# Altium schematic sheet Sheet1.SchDoc
size 300 x 200 mm
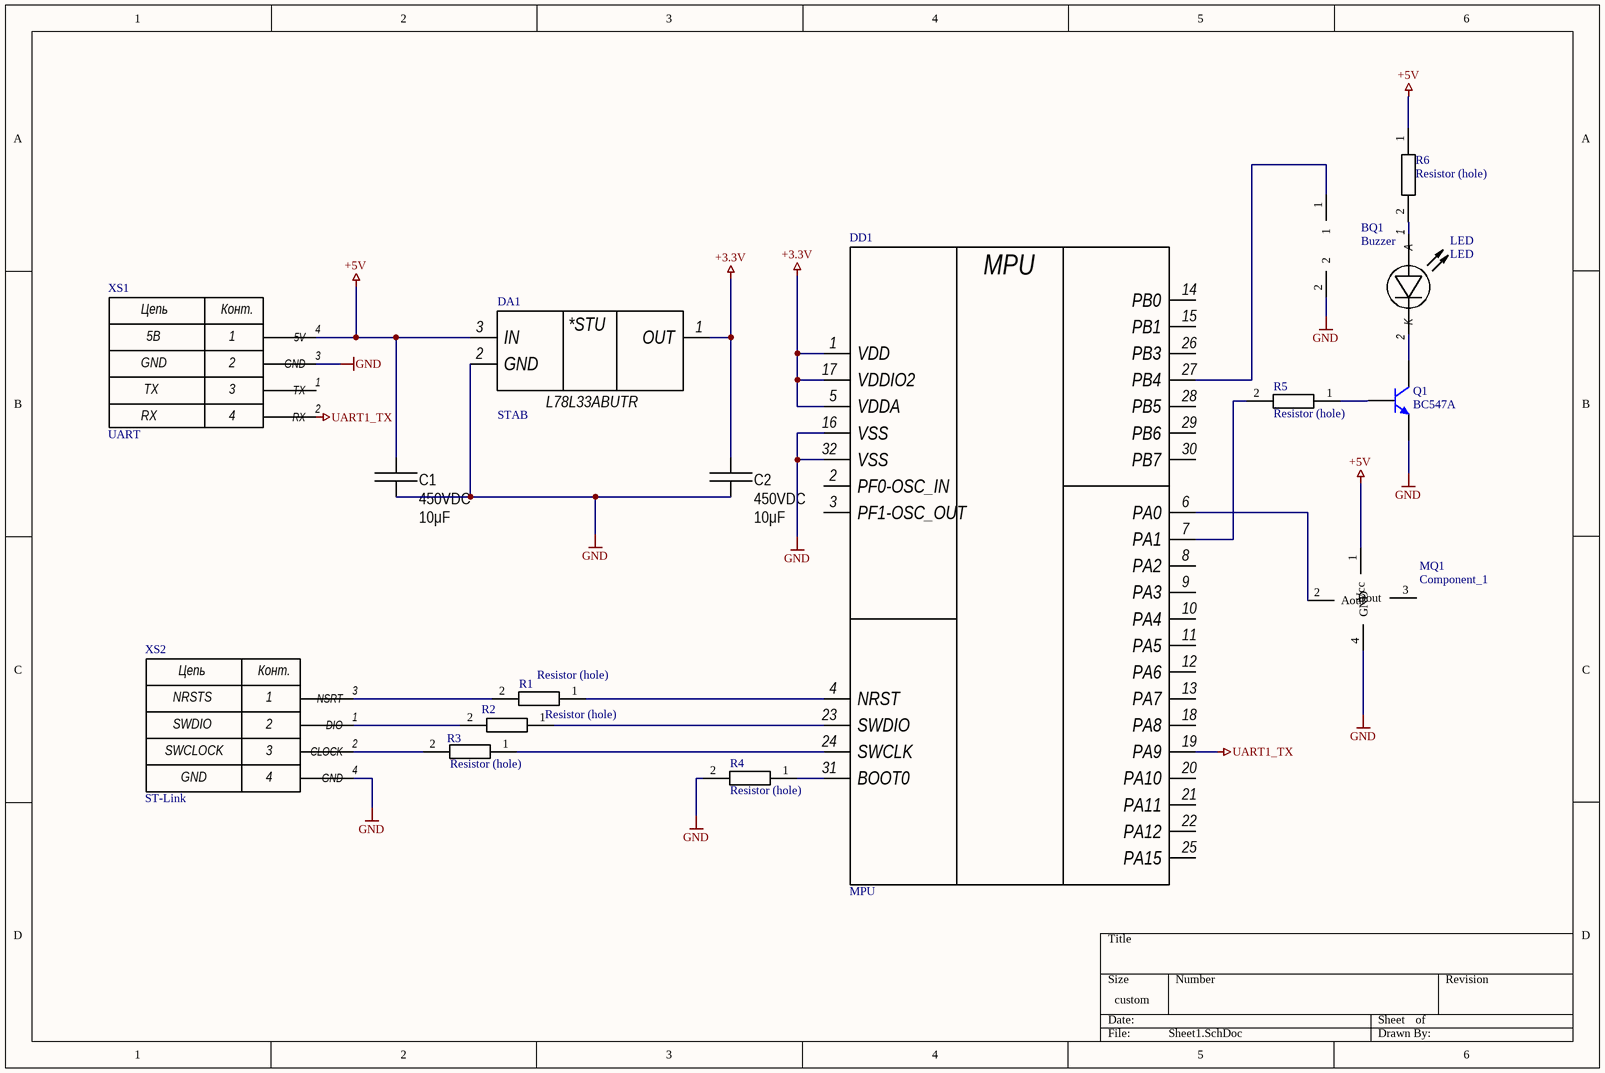
[diagram p0: Sheet1.SchDoc]

## Parts
BQ1  Buzzer  [Buzzer 3V]
C1  value 10μF  Voltage: 450VDC  [CAP: AY2102M29Y5US63L7]
C2  value 10μF  Voltage: 450VDC  [CAP: AY2102M29Y5US63L7]
DA1  STAB  [STAB]
DD1  MPU  [PCBComponent_1]
LED  LED  [LED]
MQ1  Component_1  [Sensor]
Q1  BC547A  [TO-92A]
R1  Resistor (hole)  [Resistor 22]
R2  Resistor (hole)  [Resistor 22]
R3  Resistor (hole)  [Resistor 22]
R4  Resistor (hole)  [Resistor 22]
R5  Resistor (hole)  [Resistor 22]
R6  Resistor (hole)  [Resistor 22]
XS1  UART  [UART]
XS2  ST-Link  [ST_Link]

## Nets
+3.3V: C2.1 DA1.1(OUT) DD1.1(VDD) DD1.5(VDDA) DD1.17(VDDIO2)
+5V: C1.1 DA1.3(IN) MQ1.1(Vcc) R6.1 XS1.4(5V)
GND: BQ1.2 C1.2 C2.2 DA1.2(GND) DD1.16(VSS) DD1.32(VSS) MQ1.4(GND) Q1.1(E) R4.2 XS1.3(GND) XS2.4(GND)
UART1_TX: DD1.19(PA9) XS1.2(RX)
NetBQ1_1: BQ1.1 DD1.27(PB4)
NetDD1_4: DD1.4(NRST) R1.1
NetDD1_6: DD1.6(PA0) MQ1.2(Aout)
NetDD1_7: DD1.7(PA1) R5.2
NetDD1_23: DD1.23(SWDIO) R2.1
NetDD1_24: DD1.24(SWCLK) R3.1
NetDD1_31: DD1.31(BOOT0) R4.1
NetLED_1: LED.1(A) R6.2
NetLED_2: LED.2(K) Q1.3(C)
NetQ1_2: Q1.2(B) R5.1
NetR1_2: R1.2 XS2.3(NSRT)
NetR2_2: R2.2 XS2.1(DIO)
NetR3_2: R3.2 XS2.2(CLOCK)

Not connected (* = marked no-connect by the designer): DD1 2(PF0-OSC_IN) 3(PF1-OSC_OUT) 8(PA2) 9(PA3) 10(PA4) 11(PA5) 12(PA6) 13(PA7) 14(PB0) 15(PB1) 18(PA8) 20(PA10) 21(PA11) 22(PA12) 25(PA15) 26(PB3) 28(PB5) 29(PB6) 30(PB7); MQ1 3(Dout); XS1 1(TX)

## Notes on the sheet
- (in symbol ST-Link) Цепь; Конт.; NRSTS; SWDIO; SWCLOCK
- (in symbol STAB) *STU; L78L33ABUTR
- (in symbol UART) Цепь; Конт.; 5В

## Library data of the parts
C1 C2 = Film: Manufacturer: Epcos; PartNumber: B32774D4106K000; ValueManufacturerPartNumber: Film capacitor, 10μF, 450VDC, ±10%, 10.9mOhm, 31.5x15 mm, -40...+105°C; TypeCapacitor: Film capacitor; Tolerance: ±10%; Impedance: 10.9mOhm; Package: 31.5x15 mm; HelpURL: https://www.digikey.com/products/en/capacitors/film-capacitors/62?k=&pkeyword=&sv=0&pv2097=1958&sf=0&FV=fffc01ef%2C1f140000%2Cffe0003e%2Cffec6366&quantity=1&ColumnSort=1000011&page=1&stock=1&pageSize=25; Temperature: -40...+105°C
DD1 = Component_1
Q1 = 2N3904: NPN General Purpose Amplifier; Published: 8-Jun-2000; LatestRevisionDate: 15-Jan-2003; LatestRevisionNote: PCB Footprint 'BCY-W3/D4.7' replaced; DatasheetVersion: 1997; PackageVersion: Sep-1998; PackageReference: TO-92A; Publisher: Altium Limited; PackageDescription: TO, Flat Index; 3 In-Line, Axial Leads; Body Dia. 4.5mm; Leads 0.51 x 0.48 mm (max); ComponentLink1Description: Manufacturer Link; ComponentLink1URL: http://www.fairchildsemi.com/; ComponentLink2Description: Datasheet; ComponentLink2URL: http://www.fairchildsemi.com/ds/2N%2F2N3904.pdf